# EAGLE design Weather Station (EAGLE 9.5.2)
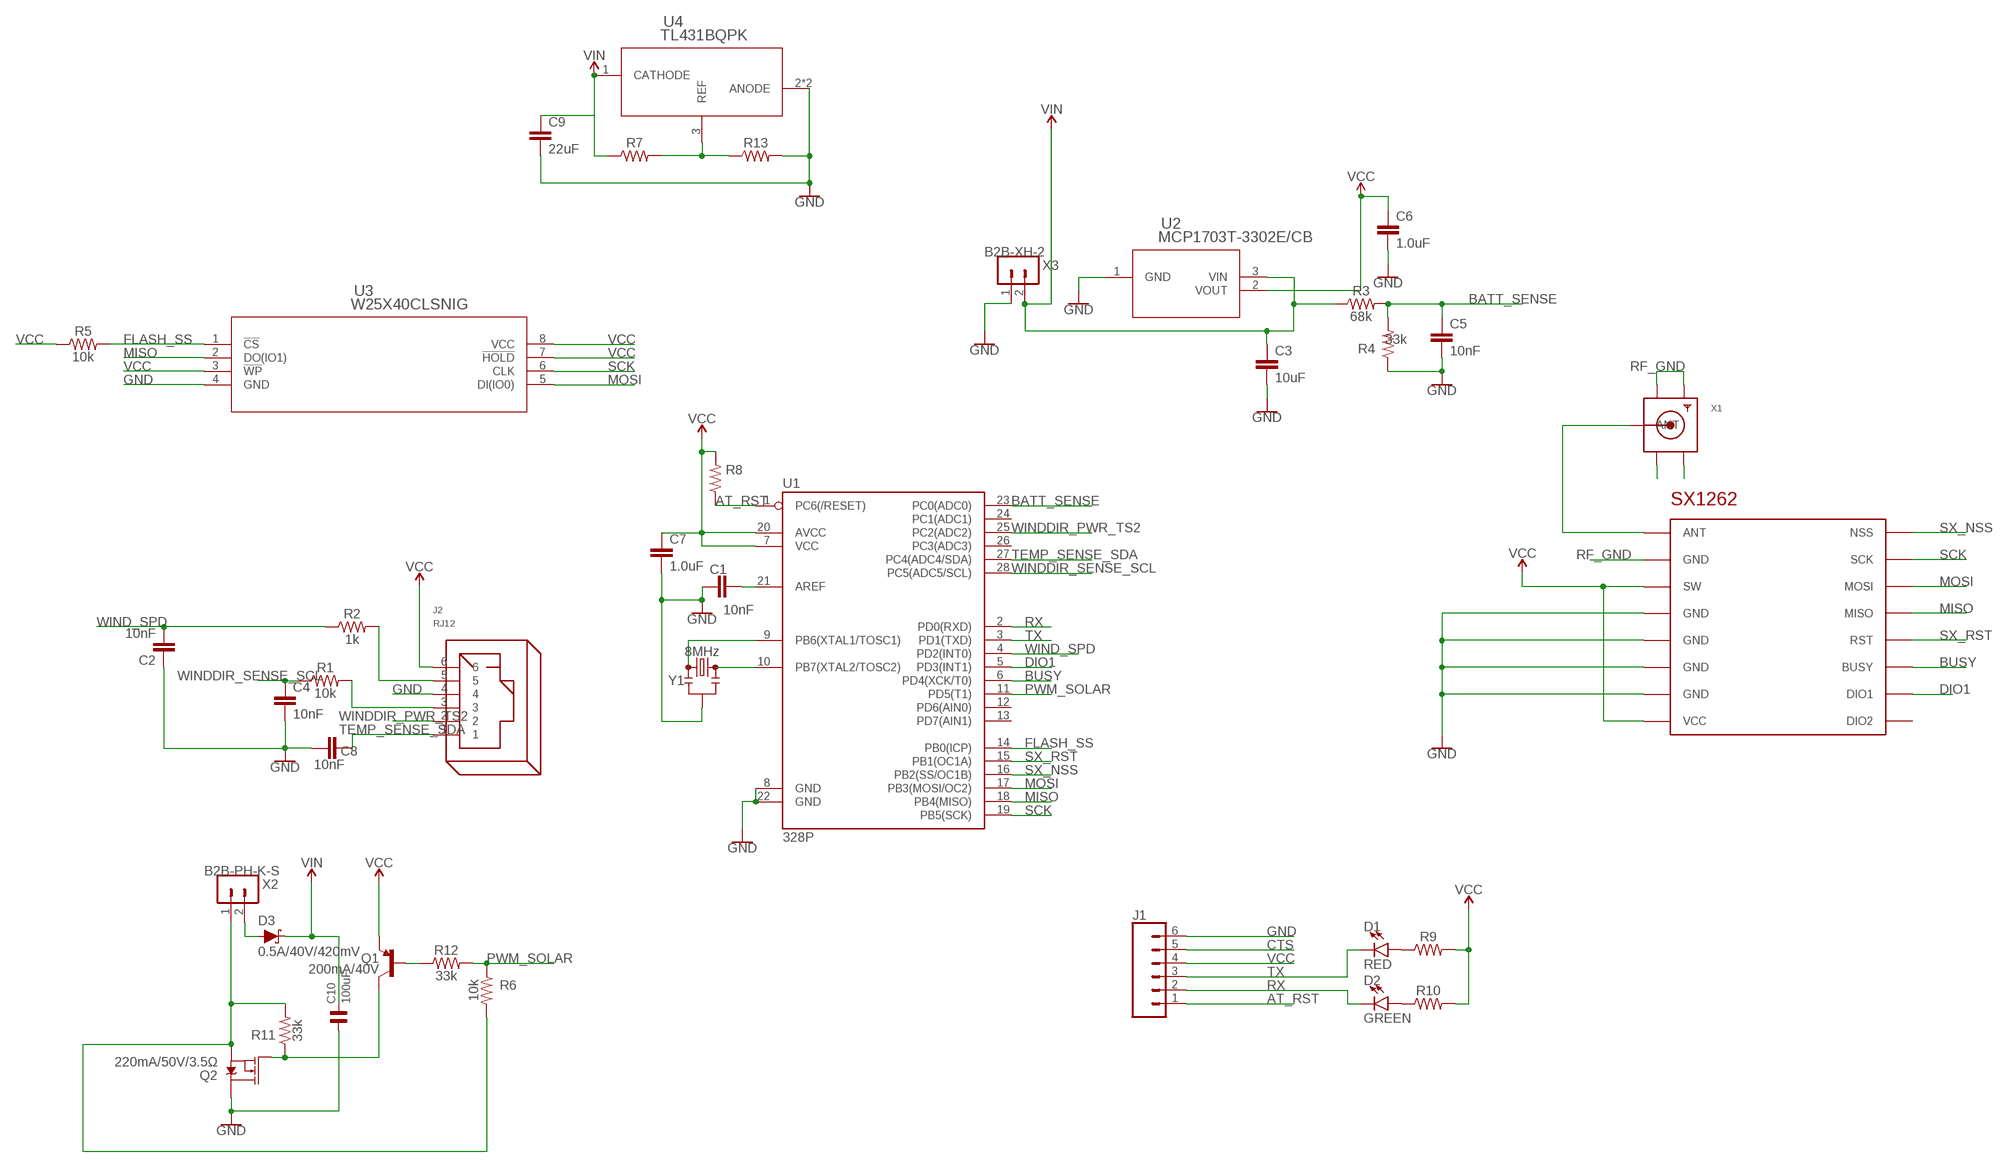
[diagram p0: schematic, sheet 1]

## Parts
C1  10nF  10NF-0603-50V-10%  [0603]
C2  10nF  10NF-0603-50V-10%  [0603]
C3  10uF  1.0UF-0603-16V-10%  [0603]
C4  10nF  10NF-0603-50V-10%  [0603]
C5  10nF  10NF-0603-50V-10%  [0603]
C6  1.0uF  1.0UF-0603-16V-10%  [0603]
C7  1.0uF  1.0UF-0805-25V-10%  [0805]
C8  10nF  10NF-0603-50V-10%  [0603]
C9  22uF  22UF-0805-6.3V-20%  [0805]
C10  100uF  C1206  [1206]
D1  RED  LED-RED1206  [LED-1206]
D2  GREEN  LED-GREEN1206  [LED-1206]
D3  0.5A/40V/420mV  DIODE-SCHOTTKY-PMEG4005EJ  [SOD-323]
J1  CONN_06NO_SILK_FEMALE_PTH  [1X06_NO_SILK]
J2  RJ12  [RJ12]
Q1  200mA/40V  TRANS_PNP-PMBT3906|MMBT3906L  [SOT23-3]
Q2  220mA/50V/3.5Ω  MOSFET-NCH-BSS138  [SOT23-3]
R1  10k  RESISTOR0805  [0805]
R2  1k  RESISTOR0805  [0805]
R3  68k  RESISTOR0805  [0805]
R4  33k  RESISTOR0805  [0805]
R5  10k  RESISTOR0805  [0805]
R6  10k  RESISTOR0805  [0805]
R7  RESISTOR0805  [0805]
R8  RESISTOR0805  [0805]
R9  RESISTOR0805  [0805]
R10  RESISTOR0805  [0805]
R11  33k  RESISTOR0805  [0805]
R12  33k  RESISTOR0805  [0805]
R13  RESISTOR0805  [0805]
U1  328P  ATMEGA328P_PDIP  [DIP28]
U2  MCP1703T-3302E/CB  [SOT-23A_MC]
U3  W25X40CLSNIG  [WIN_SN-8]
U4  TL431BQPK  [PK3]
U$1  SX1262  [SX1262]
X1  SMACONNECTOR_EDGE_UFL  [SMA_EDGELAUNCH_UFL]
X2  B2B-PH-K-S  [B2B-PH-K-S]
X3  B2B-XH-2  [B2B-XH-A]
Y1  8MHz  RESONATOR-8MHZSMD_3.2X1.3  [RESONATOR-SMD-3.2X1.3]

## Nets
ANT: U$1.ANT X1.P(ANT)
AT_RST: J1.1 R8.1 U1.1(PC6(/RESET))
BATT_SENSE: C5.1 R3.2 R4.2 U1.23(PC0(ADC0))
BUSY: U1.6(PD4(XCK/T0)) U$1.BUSY
CTS: J1.5
DIO1: U1.5(PD3(INT1)) U$1.DIO1
FLASH_SS: R5.2 U1.14(PB0(ICP)) U3.1(!CS)
GND: C1.1 C2.1 C3.2 C4.2 C5.2 C6.2 C7.2 C8.2 C9.2 C10.1 J1.6 J2.4 Q2.3(D) R4.1 R13.2 U1.8(GND) U1.22(GND) U2.1(GND) U3.4(GND) U4.2(ANODE) U4.A2(ANODE) U$1.GND@2(GND) U$1.GND@3(GND) U$1.GND@4(GND) U$1.GND@5(GND) X3.1 Y1.2
MISO: U1.18(PB4(MISO)) U3.2(DO(IO1)) U$1.MISO
MOSI: U1.17(PB3(MOSI/OC2)) U3.5(DI(IO0)) U$1.MOSI
N$1: R7.2 R13.1 U4.3(REF)
N$2: J2.5 R2.2
N$3: X1.GND@3(GND3)
N$4: D1.A R9.1
N$5: X1.GND@4(GND4)
N$6: D2.A R10.1
N$7: J2.3 R1.2
N$8: C1.2 U1.21(AREF)
N$9: Q2.2(S) R6.2 R11.2 X2.1
N$10: U1.9(PB6(XTAL1/TOSC1)) Y1.1
N$11: U1.10(PB7(XTAL2/TOSC2)) Y1.3
N$12: Q1.3(C) Q2.1(G) R11.1
N$13: Q1.1(B) R12.1
N$14: D3.A X2.2
PWM_SOLAR: R6.1 R12.2 U1.11(PD5(T1))
RF_GND: U$1.GND@1(GND) X1.GND@1(GND1) X1.GND@2(GND2)
RX: D2.C J1.2 U1.2(PD0(RXD))
SCK: U1.19(PB5(SCK)) U3.6(CLK) U$1.SCK
SX_NSS: U1.16(PB2(SS/OC1B)) U$1.NSS
SX_RST: U1.15(PB1(OC1A)) U$1.RST
TEMP_SENSE_SDA: C8.1 J2.1 U1.27(PC4(ADC4/SDA))
TX: D1.C J1.3 U1.3(PD1(TXD))
VCC: C6.1 C7.1 J1.4 J2.6 Q1.2(E) R5.1 R8.2 R9.2 R10.2 U1.7(VCC) U1.20(AVCC) U2.2(VOUT) U3.3(!WP) U3.7(!HOLD) U3.8(VCC) U$1.SW U$1.VCC
VIN: C3.1 C9.1 C10.2 D3.C R3.1 R7.1 U2.3(VIN) U4.1(CATHODE) X3.2
WIND_SPD: C2.2 R2.1 U1.4(PD2(INT0))
WINDDIR_PWR_TS2: J2.2 U1.25(PC2(ADC2))
WINDDIR_SENSE_SCL: C4.1 R1.1 U1.28(PC5(ADC5/SCL))
Unconnected: U1.12(PD6(AIN0)) U1.13(PD7(AIN1)) U1.24(PC1(ADC1)) U1.26(PC3(ADC3)) U$1.DIO2

## Library data of the parts
C1 C2 C4 C5 C8 = SparkFun-Capacitors:10NF: 0.01uF/10nF/10,000pF ceramic capacitors A capacitor is a passive two-terminal electrical component used to store electrical energy temporarily in an electric field. CAP-09321; PROD_ID: CAP-00867
C3 = SparkFun-Capacitors:1.0UF: 1µF ceramic capacitors A capacitor is a passive two-terminal electrical component used to store electrical energy temporarily in an electric field.; PROD_ID: CAP-00868; VALUE: 1.0uF
C6 = SparkFun-Capacitors:1.0UF: 1µF ceramic capacitors A capacitor is a passive two-terminal electrical component used to store electrical energy temporarily in an electric field.; PROD_ID: CAP-00868
C7 = SparkFun-Capacitors:1.0UF: 1µF ceramic capacitors A capacitor is a passive two-terminal electrical component used to store electrical energy temporarily in an electric field.; PROD_ID: CAP-08064
C9 = SparkFun-Capacitors:22UF: 22µF ceramic capacitors A capacitor is a passive two-terminal electrical component used to store electrical energy temporarily in an electric field.; PROD_ID: CAP-08402
C10 = capsmd:C1206
D1 = SparkFun-LED:LED-RED: Red SMD LED Used in manufacturing of most products at SparkFun Packages: 0603 - SMD 0603 package [Product Link] <http://docs.avagotech.com/docs/AV02-0551EN> 0603 SMART - SMD 0603 SMART package ( more efficient and expensive)[Product Link] <http://www.osram-os.com/Graphics/XPic2/00077099_0.pdf> 1206 - SMD1206 package [Product Link] <https://www.sparkfun.com/datasheets/DevTools/LilyPad/Q150OVS4.pdff> SparkFun Products: Pro Mini 328 -5V <https://www.sparkfun.com/products/821> RedBoard <https://www.sparkfun.com/products/12757> IOIO-OTG <https://www.sparkfun.com/products/13613>; PROD_ID: DIO-09912
D2 = SparkFun-LED:LED-GREEN: Green SMD LED Used in manufacturing of various products at SparkFun Packages: 0603 - SMD 0603 package [Product Link] <http://www.futureelectronics.com/en/technologies/semiconductors/optoelectronics/leds/Pages/9894312-LTST-C190GKT.aspx?CrossPart=HSMG-C190&IM=0> LilyPad 1206 - SMD1206 LilyPad package [Product Link] <http://www.futureelectronics.com/en/Technologies/Product.aspx?ProductID=IN150NGHARVATEKCORPORATION2049943&IM=0> 1206 - SMD1206 package [Product Link] <http://www.futureelectronics.com/en/technologies/semiconductors/optoelectronics/leds/Pages/8315665-LTST-C150KGKT.aspx?IM=0> 1206 Bottom Mount -SMD 1206 Bottom Mount [Product Link] <http://www.digikey.com/product-detail/en/lite-on-inc/LTST-C230KGKT/160-1456-1-ND/386854> SparkFun Products: Pro Mini 328 -5V <https://www.sparkfun.com/products/821> RedBoard <https://www.sparkfun.com/products/12757> MP3 Trigger <https://www.sparkfun.com/products/13720> Makey Makey <https://www.sparkfun.com/products/11076>; PROD_ID: DIO-00862
D3 = SparkFun-DiscreteSemi:DIODE-SCHOTTKY: Schottky diode A Schottky diode is a semiconductor diode which has a low forward voltage drop and a very fast switching action.; PROD_ID: DIO-10955
J1 = SparkFun-Connectors:CONN_06: Multi connection point. Often used as Generic Header-pin footprint for 0.1 inch spaced/style header connections On any of the 0.1 inch spaced packages, you can populate with these: Break Away Headers - Straight <https://www.sparkfun.com/products/116> (PRT-00116) Break Away Male Headers - Right Angle <https://www.sparkfun.com/products/553> (PRT-00553) Female Headers <https://www.sparkfun.com/products/115> (PRT-00115) Break Away Headers - Machine Pin <https://www.sparkfun.com/products/117> (PRT-00117) Break Away Female Headers - Swiss Machine Pin <https://www.sparkfun.com/products/743> (PRT-00743) Arduino Stackable Header - 6 Pin <https://www.sparkfun.com/products/9280> (PRT-09280) For SCREWTERMINALS and SPRING TERMINALS visit here: Screw Terimnals on SparkFun.com <https://www.sparkfun.com/search/results?term=Screw+Terminals> (5mm/3.5mm/2.54mm spacing) This device is also useful as a general connection point to wire up your design to another part of your project. Our various solder wires solder well into these plated through hole pads. Hook-Up Wire - Assortment (Stranded, 22 AWG) <https://www.sparkfun.com/products/11375> (PRT-11375) Hook-Up Wire - Assortment (Solid Core, 22 AWG) <https://www.sparkfun.com/products/11367> (PRT-11367) View the entire wire category on our website here <https://www.sparkfun.com/categories/141>; PROD_ID: CONN-08437
J2 = con-rj:RJ12: RJ12, RJ14 and RJ25 RJ12, RJ14 and RJ25 jacks side mounted http://www.tycoelectronics.com
Q1 = SparkFun-DiscreteSemi:TRANS_PNP: PNP transistor Current controlled devices typically used to amplify current or used as a switch. SparkFun Products: SparkFun Serial Enabled 16x2 LCD - Red on Black <https://www.sparkfun.com/products/9068> SparkFun Logomatic <https://www.sparkfun.com/products/12772>; PROD_ID: TRANS-08052
Q2 = SparkFun-DiscreteSemi:MOSFET-NCH: N-channel MOSFETs Voltage controlled devices that allow control of high current outputs. SparkFun Products: SparkFun OpenScale <https://www.sparkfun.com/products/13261> SparkFun Digital Sandbox <https://www.sparkfun.com/products/12651> SparkFun Monster Moto Shield <https://www.sparkfun.com/products/10182> SparkFun MOSFET Power Controller <https://www.sparkfun.com/products/11214>; PROD_ID: TRANS-00830
R1-R13 = SparkFun-Resistors:RESISTOR: Generic Resistor Package
U1 = SparkFun-IC-Microcontroller:ATMEGA328P_PDIP: Atmel 328P Through hole ATMEGA328P uC used in the Arduino 32kb flash, 1k EEPROM, 2k SRAM Datasheet <http://www.sparkfun.com/datasheets/Components/SMD/ATMega328.pdf> SparkFun Products Storefront component: AVR 28 Pin 20MHz 32K 6A/D - ATMega328P <https://www.sparkfun.com/products/9061> (COM-09061) SparkFun Simon Says - Through-Hole Soldering Kit <https://www.sparkfun.com/products/10547> (KIT-10547) SparkFun Learn to Solder - Simon Says <https://www.sparkfun.com/products/13708> (KIT-13708) SparkFun BigTime Watch Kit <https://www.sparkfun.com/products/11734> (KIT-11734) SparkFun ClockIt <https://www.sparkfun.com/products/10930> (KIT-10930) SparkFun Serial Enabled LCD Kit <https://www.sparkfun.com/products/10097> (LCD-10097) SparkFun Simon Tilts - Through Hole Soldering Kit <https://www.sparkfun.com/products/12634> (KIT-12634) SparkFun Frequency Counter Kit <https://www.sparkfun.com/products/10140> (KIT-10140) FabFM Radio Kit <https://www.sparkfun.com/products/11043> (KIT-11043) SparkFun Binary Blaster Kit <https://www.sparkfun.com/products/12037> (KIT-12037) SparkFun Metro-Gnome <https://www.sparkfun.com/products/9236> (KIT-09236) ATmega328 with Arduino Optiboot (Uno) <https://www.sparkfun.com/products/10524> (DEV-10524); PROD_ID: IC-09136
U2 = my-components:MCP1703T-3302E/CB; BUILT_BY: EMA_UL_Team; MANUFACTURER_PART_NUMBER: MCP1703T-3302E/CB; VENDOR: Microchip
U3 = my-components:W25X40CLSNIG: 16MB SPI flash; BUILT_BY: EMA_UL_Team; MANUFACTURER_PART_NUMBER: W25X40CLSNIG; VENDOR: Winbond
U4 = my-components:TL431BQPK: 100mA voltage reference; BUILT_BY: EMA_UL_Team; MANUFACTURER_PART_NUMBER: TL431BQPK; VENDOR: Texas Instruments
U$1 = RadioShield:SX1262
X1 = adafruit:SMACONNECTOR: SMA Connector 90° DIP SMA Connector, 50 Ohm (4UConnector: 07259)
X2 = con-JST PH:B2B-PH: JST PH series header 2.00mm pitch disconnectable crimp style connectors, vertical (side entry type), 2 pins
X3 = con-JST XH:B2B-XH: JST XH series header 2.50mm pitch disconnectable crimp style connectors, vertical (side entry type), 2 pins
Y1 = SparkFun-Clocks:RESONATOR-8MHZ: 8MHz Resonator Digikey Example <http://www.digikey.com/product-detail/en/murata-electronics-north-america/CSTCE10M0G55-R0/490-1196-1-ND/584633> Frequency: 8MHz Frequency Stability: ±0.2% Frequency Tolerance: ±0.5% Capacitance: 33pF SparkFun Products Arduino Pro Mini 328- 3.3V/8MHz <https://www.sparkfun.com/products/11114> SparkFun Digital Sandbox <https://www.sparkfun.com/products/12651>; PROD_ID: XTAL-08895

## Board
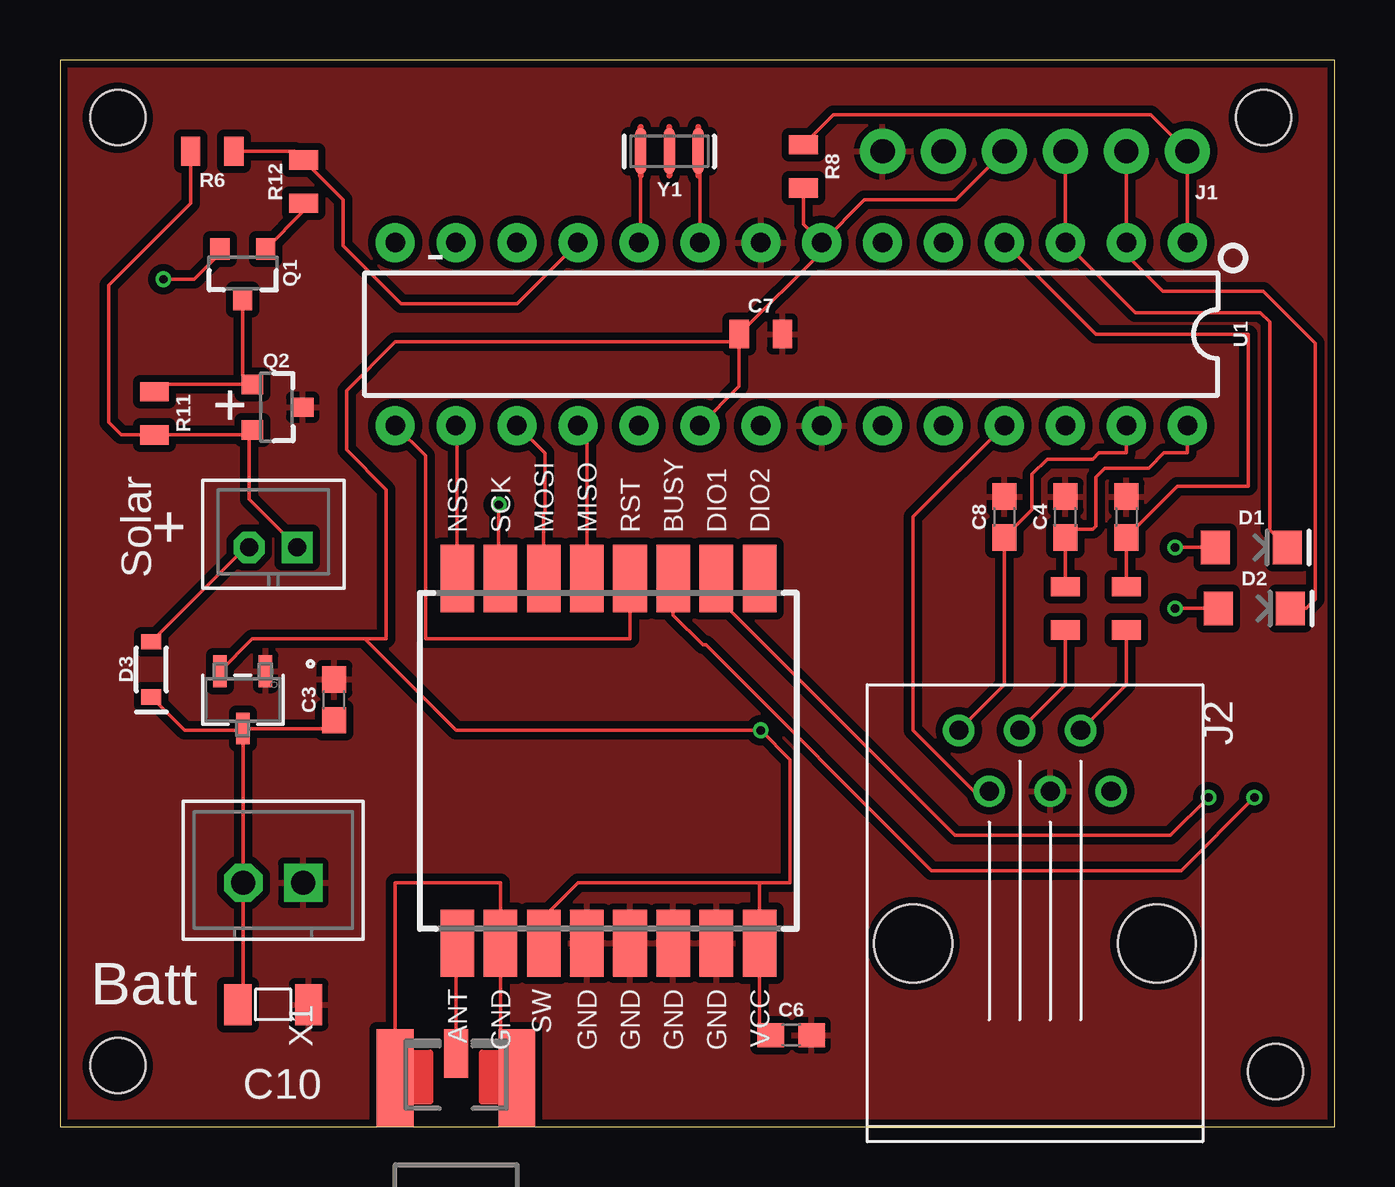
[diagram p1: board, top side]
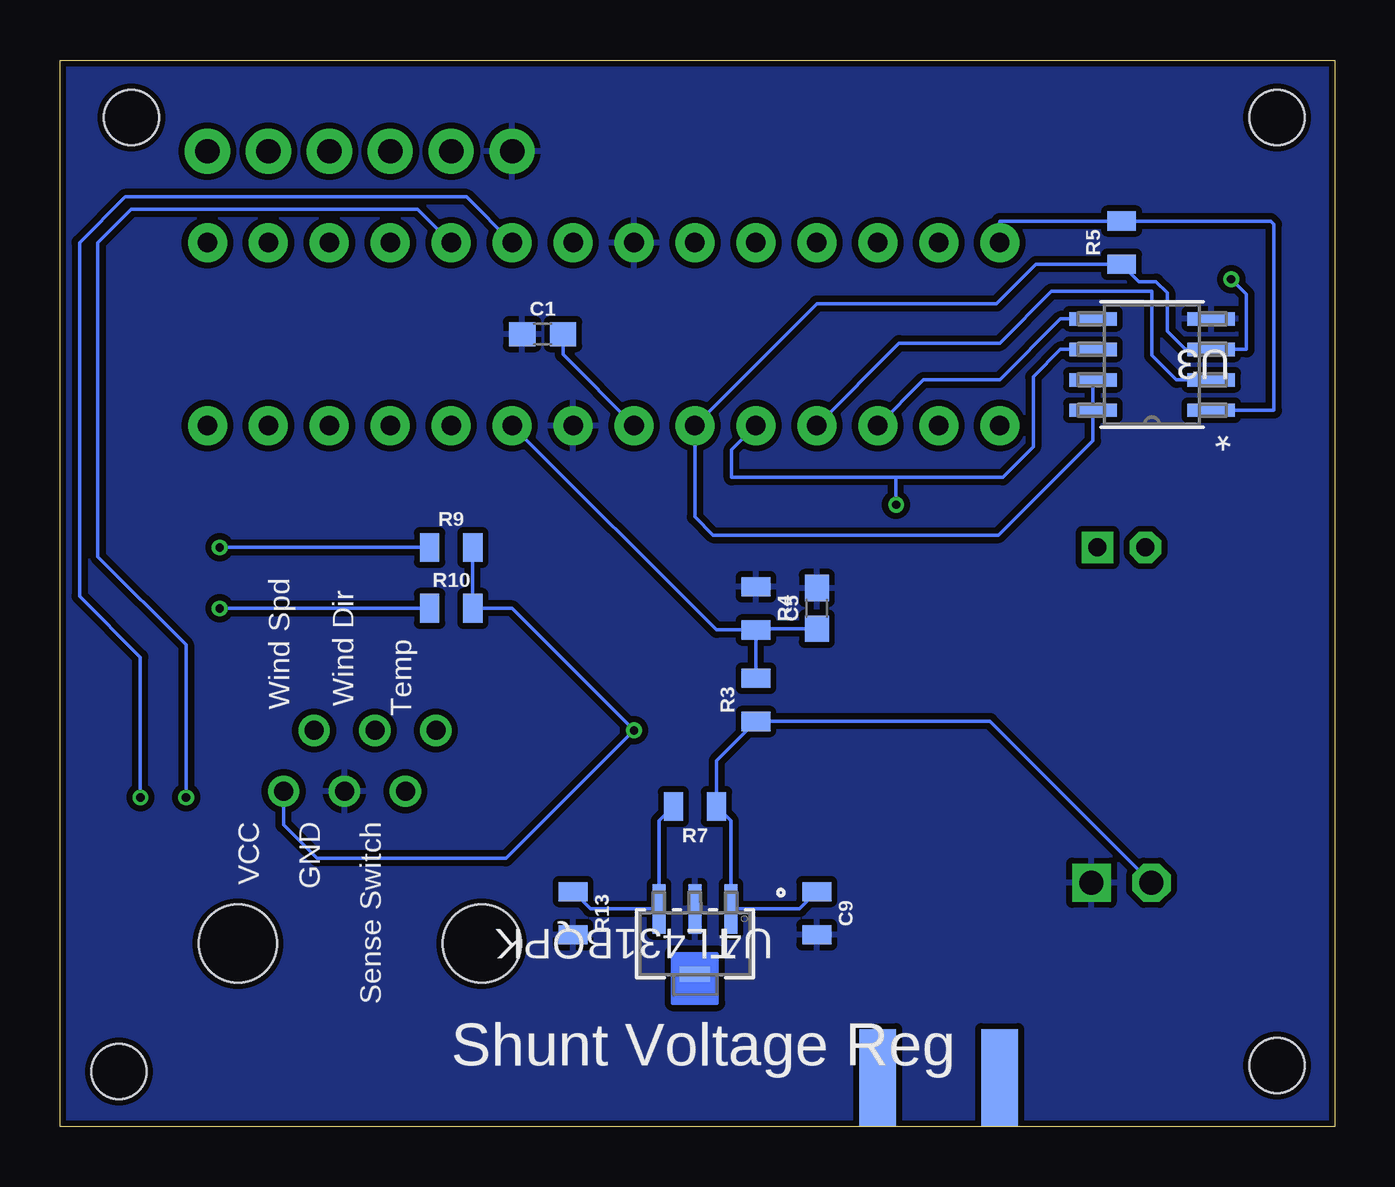
[diagram p2: board, bottom side, seen from below]

Size 53.14 x 44.44 mm. Coordinates in mm from the lower left corner, seen from the top.
Outline: 0,0 53.14,0 53.14,44.44 0,44.44 0,0
Copper layers (1*16): Top 0.035mm / dielectric 1.5mm / Bottom 0.035mm
Design rules "dirt_cheap_dirty_boards.v1.1 *": minimum track width 6mil, minimum drill 12mil, track to track 10mil, track to pad 10mil, pad to pad 10mil, via to via 10mil, smd to smd 0mil, copper to edge 10mil, drill to drill 10mil, minimum pad ring 10mil, minimum via ring 6mil, stop-mask expansion 2mil, vias tented up to drill 25mil, thermal gap 10mil
Holes 2.3 mm at 2.41,42.04 50.16,42.04 2.41,2.54 50.67,2.29

### Footprints (pad centres in the part's own frame; a part is rotated, then mirrored left to right if it is on the bottom)
0603 = smd 1.1 x 1: 1 -0.85,0; 2 0.85,0
0805 = smd 0.8 x 1.2: 1 -0.9,0; 2 0.9,0
1206 = smd 1.143 x 1.702: 1 -1.473,0; 2 1.473,0
LED-1206 = smd 1.2 x 1.4: A -1.5,0; C 1.5,0
SOD-323 = smd 0.63 x 0.83: A 1.15,0; C -1.15,0
1X06_NO_SILK = drill 1.016 pad 1.88: 1 0,0; 2 2.54,0; 3 5.08,0; 4 7.62,0; 5 10.16,0; 6 12.7,0
RJ12 = drill 0.8: 1 -8.89,-3.175; 2 -6.35,-1.905; 3 -8.89,-0.635; 4 -6.35,0.635; 5 -8.89,1.905; 6 -6.35,3.175 | hole 3.25: 0,-5.08; 0,5.08
SOT23-3 = smd 0.8 x 0.9: 1 -0.95,-1; 2 0.95,-1; 3 0,1.1
DIP28 = drill 0.813 pad 1.626: 1 -16.51,-3.81; 2 -13.97,-3.81; 3 -11.43,-3.81; 4 -8.89,-3.81; 5 -6.35,-3.81; 6 -3.81,-3.81; 7 -1.27,-3.81; 8 1.27,-3.81; 9 3.81,-3.81; 10 6.35,-3.81; 11 8.89,-3.81; 12 11.43,-3.81; 13 13.97,-3.81; 14 16.51,-3.81; 15 16.51,3.81; 16 13.97,3.81; 17 11.43,3.81; 18 8.89,3.81; 19 6.35,3.81; 20 3.81,3.81; 21 1.27,3.81; 22 -1.27,3.81; 23 -3.81,3.81; 24 -6.35,3.81; 25 -8.89,3.81; 26 -11.43,3.81; 27 -13.97,3.81; 28 -16.51,3.81
SOT-23A_MC = smd 0.559 x 1.321: 1 -0.95,-1.195; 2 0.95,-1.195; 3 0,1.195
WIN_SN-8 = smd 1.981 x 0.559: 1 -2.464,1.905; 2 -2.464,0.635; 3 -2.464,-0.635; 4 -2.464,-1.905; 5 2.464,-1.905; 6 2.464,-0.635; 7 2.464,0.635; 8 2.464,1.905
PK3 = smd 0.533 x 2.057: 1 -1.5,-1.448; 2 0,-1.448; 3 1.5,-1.448 | smd 1.27 x 0.635: A2 0,1.27
SX1262 = smd 2.8 x 1.4: ANT -7.6,6.3; BUSY 7.6,-2.7; DIO1 7.6,-4.5; DIO2 7.6,-6.3; GND@1 -7.6,4.5; GND@2 -7.6,0.9; GND@3 -7.6,-0.9; GND@4 -7.6,-2.7; GND@5 -7.6,-4.5; MISO 7.6,0.9; MOSI 7.6,2.7; NSS 7.6,6.3; RST 7.6,-0.9; SCK 7.6,4.5; SW -7.6,2.7; VCC -7.6,-6.3
SMA_EDGELAUNCH_UFL = smd 4.064 x 1.524: GND@1 2.032,-2.54; GND@2 2.032,2.54 | smd 4.064 x 1.524 bottom: GND@3 2.032,2.54; GND@4 2.032,-2.54 | smd 2.032 x 1.016: P 3.048,0
B2B-PH-K-S = drill 0.75 pad 1.3 square: 1 1,0 | drill 0.75 pad 1.3 octagon: 2 -1,0
B2B-XH-A = drill 1 pad 1.6 square: 1 1.25,0 | drill 1 pad 1.6 octagon: 2 -1.25,0
RESONATOR-SMD-3.2X1.3 = smd 0.45 x 1.905: 1 -1.2,0; 2 0,0; 3 1.2,0

### Placement (x,y rotation side)
C1  33.02,33.02 0 bottom
C2  44.45,25.4 270 top
C3  11.43,17.78 90 top
C4  41.91,25.4 90 top
C5  21.59,21.59 90 bottom
C6  30.48,3.81 0 top
C7  29.21,33.02 0 top
C8  39.37,25.4 90 top
C9  21.59,8.89 270 bottom
C10  8.89,5.08 180 top
D1  49.66,24.13 0 top
D2  49.78,21.59 0 top
D3  3.81,19.05 90 top
J1  46.99,40.64 180 top
J2  40.64,7.62 270 top
Q1  7.62,35.56 180 top
Q2  9.02,29.97 270 top
R1  41.91,21.59 270 top
R2  44.45,21.59 270 top
R3  24.13,17.78 90 bottom
R4  24.13,21.59 270 bottom
R5  8.89,36.83 90 bottom
R6  6.35,40.64 180 top
R7  26.67,13.34 180 bottom
R8  30.99,40.01 270 top
R9  36.83,24.13 0 bottom
R10  36.83,21.59 0 bottom
R11  3.94,29.72 270 top
R12  10.16,39.37 90 top
R13  31.75,8.89 270 bottom
U1  30.48,33.02 180 top
U2  7.62,17.78 180 top
U3  7.62,31.75 180 bottom
U4  26.67,7.62 180 bottom
U$1  22.86,15.24 90 top
X1  16.51,0 90 top
X2  8.89,24.13 0 top
X3  8.89,10.16 0 top
Y1  25.4,40.64 180 top

### Tracks (layer width: path | path; a pad name or v marks a point on that pad's centre or on a via)
ANT
  Top 0.152: X1.P 16.51,7.59 U$1.ANT
AT_RST
  Top 0.152: U1.1 J1.1 45.47,42.16 32.25,42.16 R8.1
BATT_SENSE
  Bottom 0.152: R3.2 R4.2 | C5.1 24.08,20.74 R4.2 | R4.2 25.77,20.69 U1.23
BUSY  (via drill 0.35)
  Top 0.152: v49.78,13.72 46.74,10.67 36.32,10.67 26.92,20.07 26.8,20.07 25.56,21.3 U$1.BUSY
  Bottom 0.152: U1.6 36.2,38.73 50.42,38.73 52.32,36.83 52.32,22.1 49.78,19.56 v49.78,13.72
DIO1  (via drill 0.35)
  Top 0.152: v47.88,13.72 46.29,12.13 37.3,12.13 27.36,22.07 U$1.DIO1
  Bottom 0.152: U1.5 38.23,38.23 50.16,38.23 51.56,36.83 51.56,23.75 47.88,20.07 v47.88,13.72
FLASH_SS
  Bottom 0.152: U1.14 13.97,37.73 R5.2 2.68,37.73 2.54,37.59 2.54,29.84 U3.1
GND
  pour Top (isolate 0.305): 0,44.45 52.96,44.45 52.96,0 0,0
  pour Bottom: 0,0 0,44.45 52.96,44.45 52.96,0
  pour Bottom (no thermals): 25.27,7.62 28.07,7.62 28.07,4.7 25.27,4.7
MISO
  Top 0.152: U$1.MISO 21.96,28.84 U1.18
  Bottom 0.152: U3.2 6.6,31.11 7.62,32.13 7.62,34.8 11.81,34.8 13.97,32.64 18.16,32.64 U1.18
MOSI
  Top 0.152: U$1.MOSI 20.16,25.58 20.22,25.64 20.22,28.04 U1.17
  Bottom 0.152: U1.17 17.14,31.11 13.97,31.11 11.43,33.66 U3.5
N$1
  Bottom 0.152: R7.2 28.17,12.73 U4.3 31.03,9.07 R13.1
N$2
  Top 0.152: R2.2 44.45,18.41 J2.5
N$4  (via drill 0.35)
  Top 0.152: D1.A v46.48,24.13
  Bottom 0.152: v46.48,24.13 R9.1
N$6  (via drill 0.35)
  Top 0.152: D2.A v46.48,21.59
  Bottom 0.152: v46.48,21.59 R10.1
N$7
  Top 0.152: J2.3 41.91,18.41 R1.2
N$8
  Bottom 0.152: C1.2 32.17,32.17 U1.21
N$9
  Top 0.152: X2.1 7.89,26.13 7.89,28.82 | Q2.2 8.02,28.82 7.89,28.82 | 7.89,28.82 R11.2 2.55,28.82 2.03,29.34 2.03,35.05 5.45,38.47 R6.2
N$10
  Top 0.152: Y1.1 26.67,40.57 U1.9
N$11
  Top 0.152: U1.10 24.2,36.9 Y1.3
N$12
  Top 0.152: R11.1 4.24,30.92 Q2.1 7.62,31.32 Q1.3
N$13
  Top 0.152: R12.1 10.16,38.15 Q1.1
N$14
  Top 0.152: D3.A 7.74,24.13 X2.2
PWM_SOLAR
  Top 0.152: U1.11 19.05,34.29 14.22,34.29 11.81,36.7 11.81,38.62 R12.2 9.79,40.64 R6.1
RF_GND
  Top 0.152: X1.GND@1 18.36,2.72 U$1.GND@1 18.36,10.16 13.97,10.16 X1.GND@2
RX
  Top 0.152: J1.2 U1.2 44.45,36.32 45.97,34.8 50.16,34.8 52.32,32.64 52.32,21.97 51.94,21.59 D2.C
SCK  (via drill 0.35)
  Top 0.152: U$1.SCK 18.29,22.91 v18.29,25.91
  Bottom 0.152: U1.19 25.15,28.19 25.15,27.05 18.29,27.05 | U3.6 11.43,32.38 12.57,31.24 12.57,28.32 13.84,27.05 18.29,27.05 | v18.29,25.91 18.29,27.05
SX_NSS
  Top 0.152: U1.16 16.56,29.16 U$1.NSS
SX_RST
  Top 0.152: U1.15 15.24,27.94 15.24,20.32 23.76,20.32 U$1.RST
TEMP_SENSE_SDA
  Top 0.152: U1.27 44.45,28.07 43.31,28.07 43.05,27.81 41.15,27.81 40.51,27.18 40.51,25.69 C8.1 39.37,18.41 J2.1
TX
  Top 0.152: J1.3 U1.3 44.83,33.91 50.04,33.91 50.42,33.53 50.42,24.87 D1.C
VCC  (via drill 0.35)
  Top 0.152: U2.2 8.02,20.32 12.7,20.32 | U1.20 28.31,30.85 C7.1 | C7.1 27.99,32.7 13.97,32.7 11.94,30.67 11.94,28.19 13.59,26.54 13.59,20.32 12.7,20.32 | U1.7 31.75,36.46 C7.1 | U1.7 33.53,38.61 37.34,38.61 J1.4 | U1.7 30.99,37.59 R8.2 | Q1.2 6.67,36.39 5.59,35.31 v4.32,35.31 | 29.16,10.16 U$1.VCC 29.16,4.28 C6.1 | U$1.SW 20.16,8.73 21.59,10.16 29.16,10.16 | 29.16,10.16 30.43,10.16 30.43,15.29 v29.21,16.51 16.51,16.51 12.7,20.32
  Bottom 0.152: R9.2 R10.2 34.29,21.59 v29.21,16.51 34.54,11.18 42.42,11.18 43.81,12.57 J2.6 | U3.7 U3.8 10.08,28.57 14.02,24.64 25.91,24.64 26.67,25.4 U1.20 21.59,34.29 14.1,34.29 12.46,35.93 R5.1 8.16,35.2 7.45,35.2 6.99,34.74 6.99,33.15 6.22,32.38 U3.3 3.68,32.38 3.68,34.67 v4.32,35.31
VIN
  Top 0.152: 7.64,16.51 7.64,16.57 U2.3 11.09,16.59 C3.1 | 7.64,16.51 X3.2 7.64,5.3 C10.2 | D3.C 5.2,16.51 7.64,16.51
  Bottom 0.152: X3.2 14.37,16.89 24.12,16.89 R3.1 25.77,15.24 R7.1 25.17,12.73 U4.1 22.31,9.07 C9.1
WIND_SPD
  Top 0.152: R2.1 C2.2 46.57,26.67 49.53,26.67 49.53,33.02 43.18,33.02 U1.4
WINDDIR_PWR_TS2
  Top 0.152: J2.2 38.1,13.97 35.56,16.51 35.56,25.4 U1.25
WINDDIR_SENSE_SCL
  Top 0.152: U1.28 46.99,28.07 46.02,28.07 45.38,27.43 43.56,27.43 43.18,27.05 43.18,25.02 43.05,24.89 42.25,24.89 C4.1 R1.1

### Text on the board
tPlace: - | + | + | Solar | Batt
bPlace: Wind Spd | Wind Dir | Temp | Sense Switch | GND | VCC | Shunt Voltage Reg